# Altium schematic sheet [3] Normal operation.SchDoc
size A4; DocumentNumber: 4; SheetNumber: 4; SheetTotal: 11
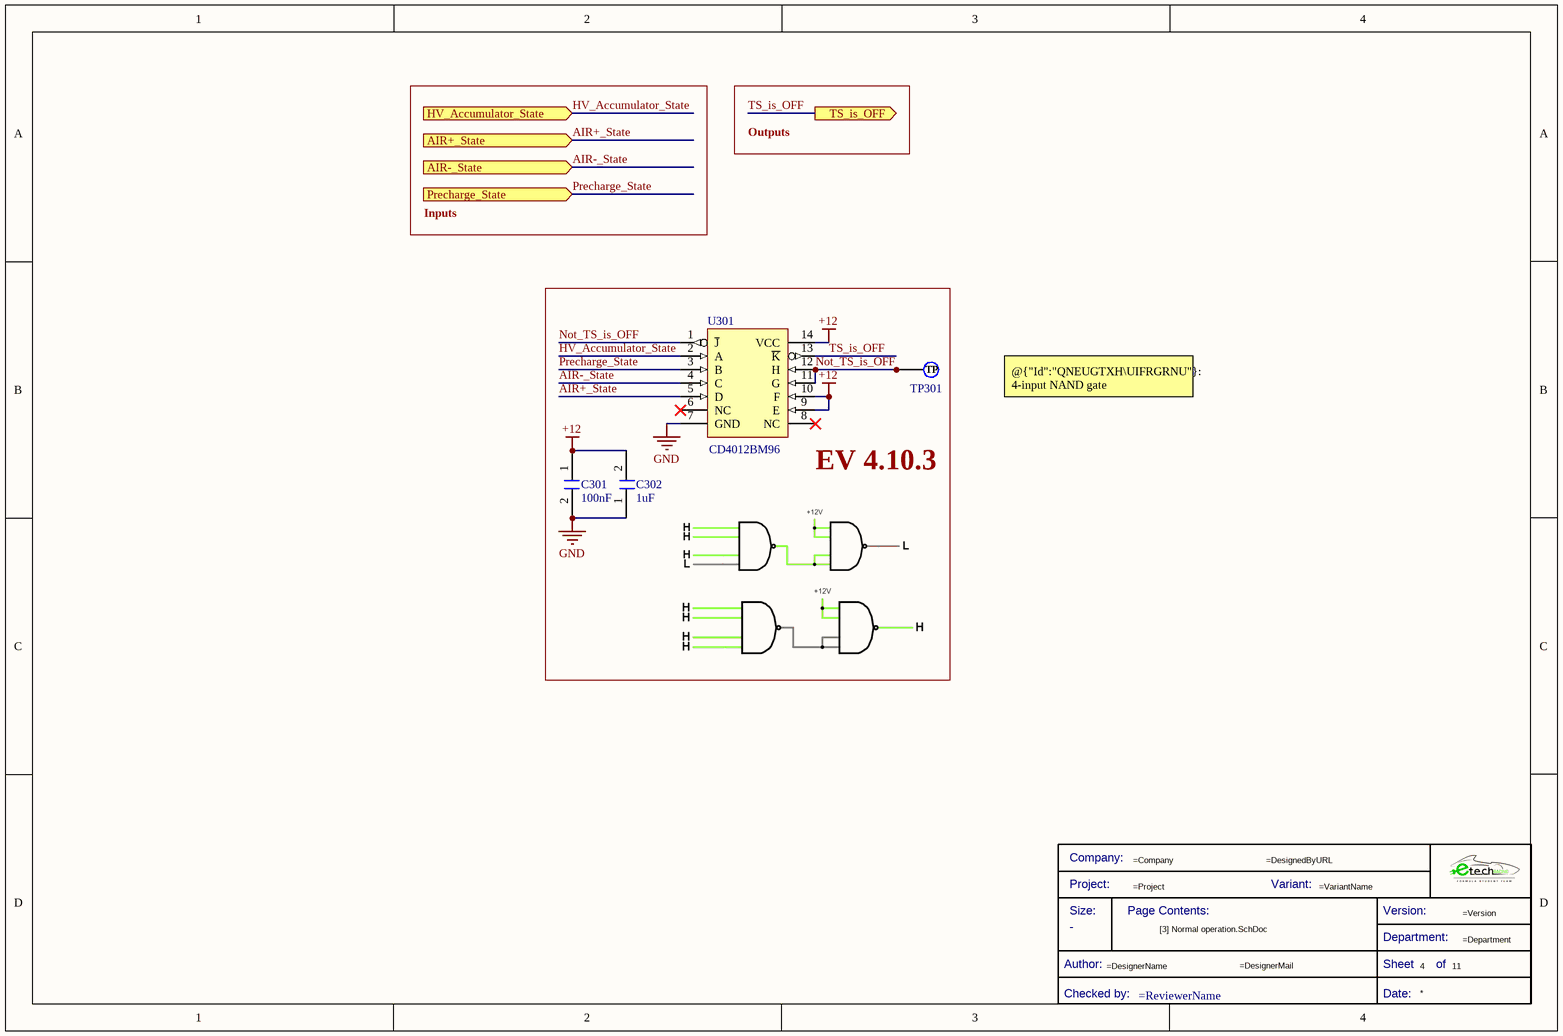
[diagram p0: [3] Normal operation.SchDoc]

## Parts
*?  Title Block_template  (value not drawn)  (graphical)
C301  Capacitance: 100nF  [C0805FNPC-R]  (hidden comment: 885012207098)
C302  Capacitance: 1uF  [C0805FNPC-R]  (hidden comment: 885012207103)
TP301  TestPoint  [TestPoint]  (value not drawn)  (no BOM)
U301  CD4012BM96  [ARRAY_4_NAND]

## Blocks framed on the sheet
EV 4.10.3: C301 C302 TP301 U301

## Ports
AIR+_State (in), AIR-_State (in), HV_Accumulator_State (in), Precharge_State (in), TS_is_OFF (out)

## Nets
+12: C301.1 C302.2 U301.9(E) U301.10(F) U301.14(VCC)
GND: C301.2 C302.1 U301.7(GND)
AIR+_State: U301.5(D) ; port AIR+_State
AIR-_State: U301.4(C) ; port AIR-_State
HV_Accumulator_State: U301.2(A) ; port HV_Accumulator_State
Not_TS_is_OFF: TP301.1(TP) U301.1(~{J}) U301.11(G) U301.12(H)
Precharge_State: U301.3(B) ; port Precharge_State
TS_is_OFF: U301.13(~{K}) ; port TS_is_OFF

Not connected (* = marked no-connect by the designer): U301 6(NC)* 8(NC)*

## Notes on the sheet
- Outputs
- Inputs
- @{"Id":"QNEUGTXH\UIFRGRNU"}: 4-input NAND gate
- (in symbol Title Block_template) Company:; Project:; Variant:; Size:; Page Contents:; Version:; Department:; Author:; Sheet; of; Checked by:; Date:

## Library data of the parts
*? = Title Block_template: Standard Title Block; .Creator: GP; Category: Title Block; .PCBcheck: GP; .SCHcheck: GP; Checked by:: =ReviewerName; Size: -
C301 = C100n-50V-0805FNPC-X7R: Cap, 0.1ΜF, 50V, 10%, X7R, 0805; Manufacturer 1: Wurth Electronics; .Creator: DR; Supplier 1: RSComponents; Manufacturer Part Number 1: 885012207098; RoHS: Yes; Category: Ceramic Capacitors; Stock 1: 8000; Pricing 1: 100=0,10200, 500=0,07100, 2000=0,06100 (GBP); Mount: Surface Mount; Case/Package: 0805; Case Code (Metric): 2012; Case Code (Imperial): 0805; Min Operating Temperature: -55°C; Max Operating Temperature: 125°C; Packaging: Cut Tape; Voltage Rating: 50V; Dielectric: X7R; Tolerance: 10%; Voltage Rating (DC): 50V; Length: 0.079inch; Width: 0.049inch; Thickness: 0.035inch; REACH SVHC: Unknown; RoHS Compliant: Yes; ComponentLink1URL: http://www.farnell.com/datasheets/1958498.pdf?src-supplier=Farnell; ComponentLink1Description: http://www.farnell.com/datasheets/1958498.pdf?src-supplier=Farnell; ComponentLink2URL: http://www.farnell.com/datasheets/1958498.pdf?src-supplier=Element14; ComponentLink2Description: http://www.farnell.com/datasheets/1958498.pdf?src-supplier=Element14; ComponentLink3URL: https://katalog.we-online.de/pbs/datasheet/885012207098.pdf?src-supplier=Digi-Key; ComponentLink3Description: https://katalog.we-online.de/pbs/datasheet/885012207098.pdf?src-supplier=Digi-Key; ComponentLink4URL: http://www.farnell.com/datasheets/1958498.pdf?src-supplier=Newark; ComponentLink4Description: http://www.farnell.com/datasheets/1958498.pdf?src-supplier=Newark; Supplier Part Number 1: 1813493
C302 = C1u-50V-0805FNPC-X7R: Multilayer Ceramic Capacitor, Wcap-Csgp Series, 1 F, 10%, X7R, 50 V, 0805 [2012 Metric] Rohs Compliant: Yes; Manufacturer 1: Wurth Electronics; Voltage Rating: 50V; .Creator: GP; Supplier 1: RSComponents; Manufacturer Part Number 1: 885012207103; RoHS: Yes; Category: Ceramic Capacitors; Stock 1: 5100; Pricing 1: 50=0,27200, 250=0,25300, 500=0,22800, 1250=0,20100, 2500=0,17100 (GBP); Mount: Surface Mount; Case/Package: 0805; Case Code (Metric): 2012; Case Code (Imperial): 0805; Min Operating Temperature: -55°C; Max Operating Temperature: 85°C; Packaging: Cut Tape; Dielectric: X7R; Tolerance: 10%; Voltage Rating (DC): 50V; Length: 0.079inch; Width: 0.049inch; Thickness: 0.053inch; REACH SVHC: Unknown; RoHS Compliant: Yes; ComponentLink1URL: http://www.farnell.com/datasheets/1958501.pdf?src-supplier=Farnell; ComponentLink1Description: http://www.farnell.com/datasheets/1958501.pdf?src-supplier=Farnell; ComponentLink2URL: http://www.farnell.com/datasheets/1958501.pdf?src-supplier=Element14; ComponentLink2Description: http://www.farnell.com/datasheets/1958501.pdf?src-supplier=Element14; ComponentLink3URL: https://katalog.we-online.de/pbs/datasheet/885012107003.pdf?src-supplier=Digi-Key; ComponentLink3Description: https://katalog.we-online.de/pbs/datasheet/885012107003.pdf?src-supplier=Digi-Key; ComponentLink4URL: http://www.farnell.com/datasheets/1958501.pdf?src-supplier=Newark; ComponentLink4Description: http://www.farnell.com/datasheets/1958501.pdf?src-supplier=Newark; Supplier Part Number 1: 1813523
TP301 = TestPoint: Test Point 1x1 mm; .Creator: GP; Category: TestPoint; .PCBcheck: GP; .SCHcheck: GP
U301 = Array_2x4_NAND: 2-ch, 4-input, 3-V to 18-V NAND gates 14-SOIC -55 to 125; Manufacturer 1: Texas Instruments; Output Current: 6.8mA; Number of Inputs: 4; Propagation Delay: 90ns; Number of Elements: 2; Max Supply Voltage: 18V; Min Supply Voltage: 3V; Number of Outputs: 1; Quiescent Current: 5uA; High Level Output Current: 3.4mA; Turn-On Delay Time: 250ns; Schmitt Trigger Input: No; Supplier 1: Digi-Key; Manufacturer Part Number 1: CD4012BM96; RoHS: Yes; Category: Logic Gates; Stock 1: 5313; Pricing 1: 1=0,66000, 10=0,56800, 25=0,53040, 100=0,42440, 250=0,39412, 500=0,33348, 1000=0,25769 (USD); Mount: Surface Mount; Case/Package: SOIC; Number of Pins: 14; Weight: 0.004564oz; Contact Plating: Gold; Min Operating Temperature: -55°C; Max Operating Temperature: 125°C; Packaging: Tape and Reel; Package Quantity: 1; Logic Function: NAND GATE; Number of Circuits: 2; Low Level Output Current: 3.4mA; Number of Gates: 2; Number of Input Lines: 4; Number of Output Lines: 1; Number of Bits: 2; Series: 4000B; Technology: CMOS; Length: 8.65mm; Width: 3.91mm; Height: 1.58mm; Radiation Hardening: No; Lead Free: Lead Free; RoHS Compliant: Yes; Reach SVHC Compliant: Yes; ComponentLink1URL: https://datasheet.ciiva.com/1865/cd4011b-1865256.pdf?src-supplier=Digi-Key; ComponentLink1Description: https://datasheet.ciiva.com/1865/cd4011b-1865256.pdf?src-supplier=Digi-Key; ComponentLink2URL: https://datasheet.ciiva.com/1865/cd4011b-1865255.pdf?src-supplier=Digi-Key; ComponentLink2Description: https://datasheet.ciiva.com/1865/cd4011b-1865255.pdf?src-supplier=Digi-Key; ComponentLink3URL: https://datasheet.ciiva.com/1865/cd4011b-1865257.pdf?src-supplier=Digi-Key; ComponentLink3Description: https://datasheet.ciiva.com/1865/cd4011b-1865257.pdf?src-supplier=Digi-Key; ComponentLink4URL: https://datasheet.ciiva.com/14307/cd4023b-14307967.pdf?src-supplier=Avnet; ComponentLink4Description: https://datasheet.ciiva.com/14307/cd4023b-14307967.pdf?src-supplier=Avnet; Supplier Part Number 1: 296-14246-1-ND